# EAGLE design Peachy1-99-6-f (EAGLE 6.5.0)

## Sheet 1 of 4
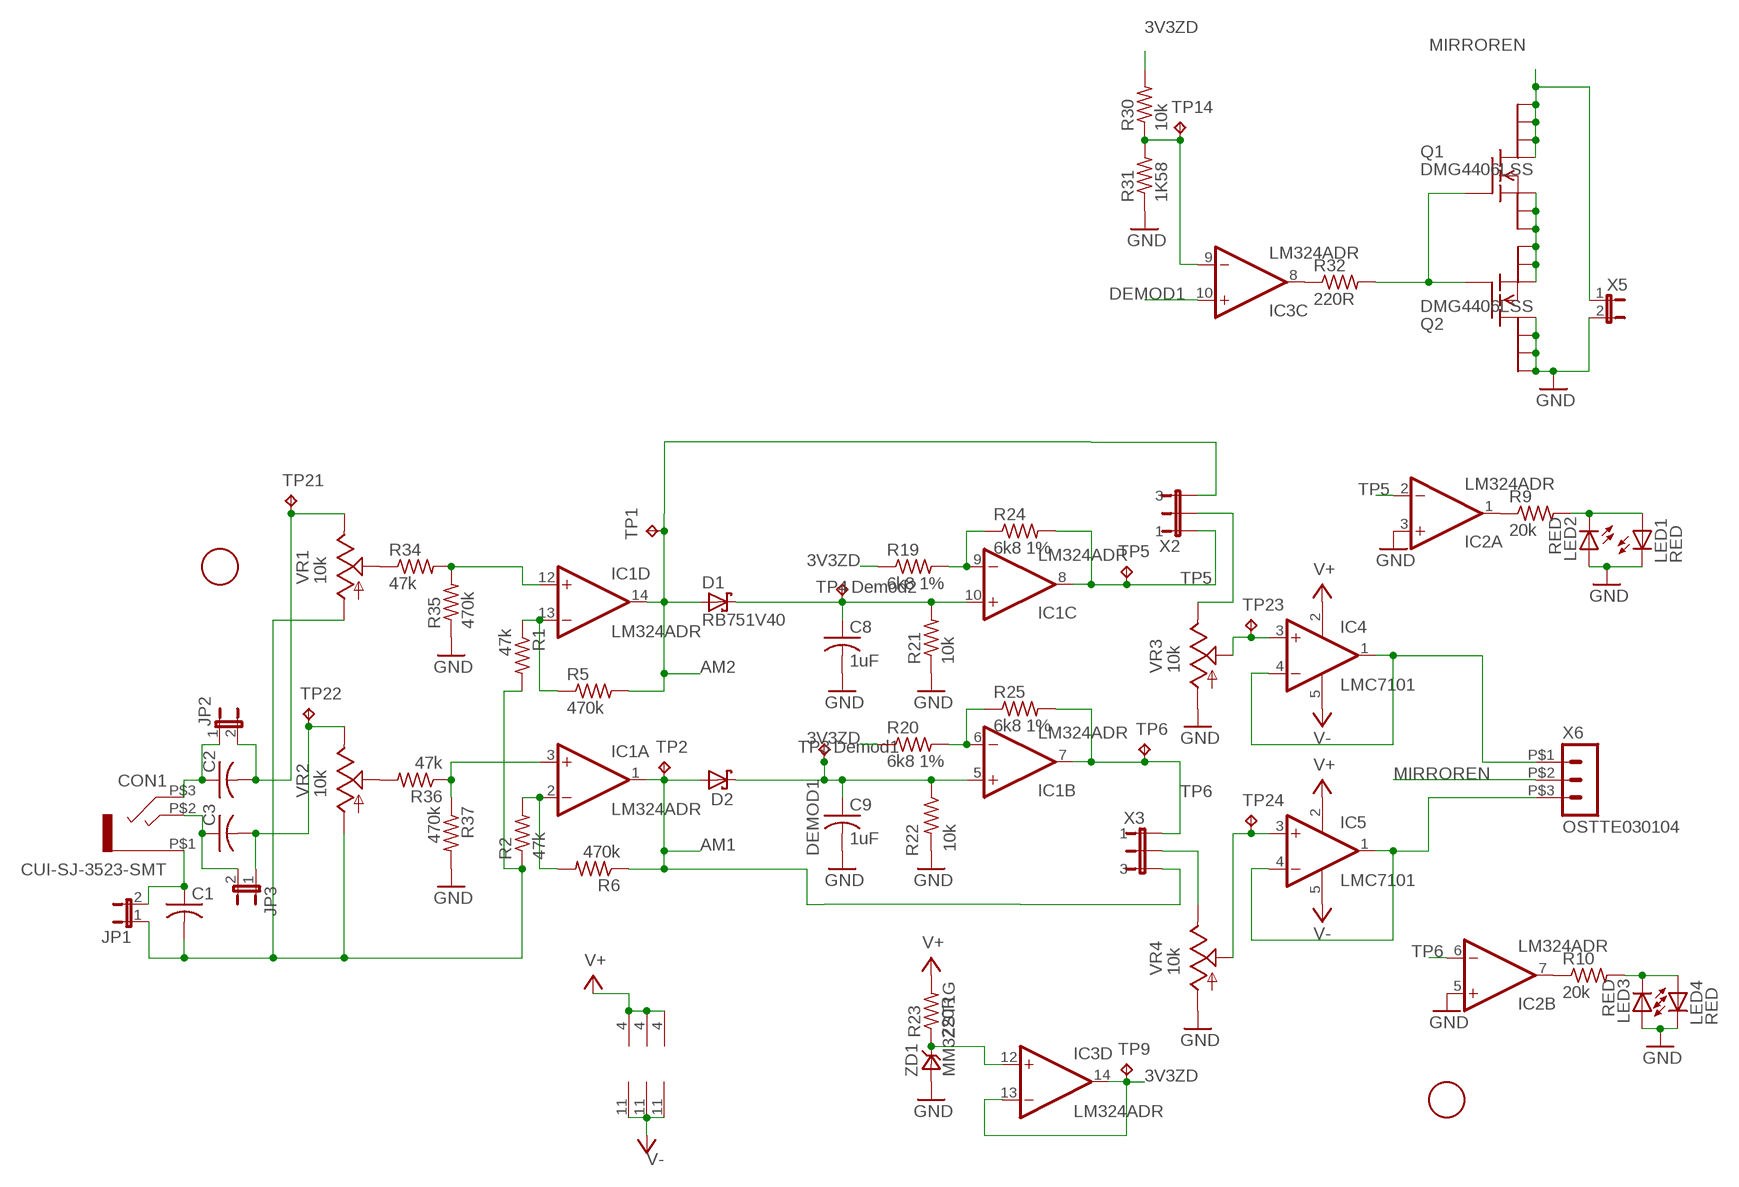
[diagram p0: schematic, sheet 1]

### Parts
C1  C-US0805  [C0805]
C2  C-US0805  [C0805]
C3  C-US0805  [C0805]
C8  1uF  C-US0805  [C0805]
C9  1uF  C-US0805  [C0805]
CON1  CUI-SJ-3523-SMT  [CUI-SJ-3523-SMT]
D1  RB751V40  [SOD323-R]
D2  RB751V40  [SOD323-R]
IC1  LM324ADR  [SOIC14(TI-PKG-D)]
IC2  LM324ADR  [SOIC14(TI-PKG-D)]
IC3  LM324ADR  [SOIC14(TI-PKG-D)]
IC4  LMC7101  [SOT23-5]
IC5  LMC7101  [SOT23-5]
JP1  JUMPER-2SMD-NC  [SJ_2S]
JP2  JUMPER-2SMD-NC  [SJ_2S]
JP3  JUMPER-2SMD-NC  [SJ_2S]
LED1  RED  LEDCHIPLED_0603  [CHIPLED_0603]
LED2  RED  LEDCHIPLED_0603  [CHIPLED_0603]
LED3  RED  LEDCHIPLED_0603  [CHIPLED_0603]
LED4  RED  LEDCHIPLED_0603  [CHIPLED_0603]
Q1  DMG4406LSS  [SO8_DMG]
Q2  DMG4406LSS  [SO8_DMG]
R1  47k  R-US_R0805  [R0805]
R2  47k  R-US_R0805  [R0805]
R5  470k  R-US_R0805  [R0805]
R6  470k  R-US_R0805  [R0805]
R9  20k  R-US_R0805  [R0805]
R10  20k  R-US_R0805  [R0805]
R19  6k8 1%  R-US_R0805  [R0805]
R20  6k8 1%  R-US_R0805  [R0805]
R21  10k  R-US_R0805  [R0805]
R22  10k  R-US_R0805  [R0805]
R23  220R  R-US_R0805  [R0805]
R24  6k8 1%  R-US_R0805  [R0805]
R25  6k8 1%  R-US_R0805  [R0805]
R30  10k  R-US_R0805  [R0805]
R31  1K58  R-US_R0805  [R0805]
R32  220R  R-US_R0805  [R0805]
R34  47k  R-US_R0805  [R0805]
R35  470k  R-US_R0805  [R0805]
R36  47k  R-US_R0805  [R0805]
R37  470k  R-US_R0805  [R0805]
TP1  TP017HOLE  [TP017TH]
TP2  TP017HOLE  [TP017TH]
TP3  TP017HOLE  [TP017TH]
TP4  TP017HOLE  [TP017TH]
TP5  TP017HOLE  [TP017TH]
TP6  TP017HOLE  [TP017TH]
TP9  TP017HOLE  [TP017TH]
TP14  TP017HOLE  [TP017TH]
TP21  TP017HOLE  [TP017TH]
TP22  TP017HOLE  [TP017TH]
TP23  TP017HOLE  [TP017TH]
TP24  TP017HOLE  [TP017TH]
U$2  FIDUCIAL  [FIDUCIAL_1MM]
U$3  FIDUCIAL  [FIDUCIAL_1MM]
VR1  10k  TRIM_US-67W  [67W]
VR2  10k  TRIM_US-67W  [67W]
VR3  10k  TRIM_US-PVZ3A  [PVZ3A]
VR4  10k  TRIM_US-PVZ3A  [PVZ3A]
X2  JUMPER-31-2  [SJ_3_PASTE1&2]
X3  JUMPER-31-2  [SJ_3_PASTE1&2]
X5  JUMPER-2SMD-NO  [SJ_2S-NO]
X6  OSTTE030104  [OSTTE030104]
ZD1  MM3ZST1G  [SOD323-R]

### Nets
3V3ZD: IC3.13(D:-IN) IC3.14(D:OUT) R19.1 R20.1 R30.2 TP9.P$1(TP) ; also sheet 3
AM1: D2.A IC1.1(A:OUT) R6.1 TP2.P$1(TP) X3.3 ; also sheet 3
AM2: D1.A IC1.14(D:OUT) R5.2 TP1.P$1(TP) X2.3
DEMOD1: C9.1 D2.C IC1.5(B:+IN) IC3.10(C:+IN) R22.1 TP3.P$1(TP)
DEMOD2: C8.1 D1.C IC1.10(C:+IN) R21.2 TP4.P$1(TP)
GND [pwr]: C8.2 C9.2 IC2.3(A:+IN) IC2.5(B:+IN) LED1.C LED2.A LED3.A LED4.C Q2.P$5(D) Q2.P$6(D) Q2.P$7(D) Q2.P$8(D) R21.1 R22.2 R31.1 R35.1 R37.2 VR3.P$1(A) VR4.P$1(A) X5.2 ZD1.A ; also sheet 2,3,4
MIRROREN [pwr]: Q1.P$5(D) Q1.P$6(D) Q1.P$7(D) Q1.P$8(D) X5.1 X6.P$2
N$3: C3.2 JP3.1 TP22.P$1(TP) VR2.E
N$4 [pwr]: C1.2 JP1.1 R1.2 R2.1 VR1.A VR2.A
N$5: R34.1 VR1.S
N$6: IC1.13(D:-IN) R1.1 R5.1
N$8: IC1.12(D:+IN) R34.2 R35.2
N$9: VR4.P$3(E) X3.2
N$10: IC3.12(D:+IN) R23.1 ZD1.C
N$12: IC1.2(A:-IN) R2.2 R6.2
N$13: IC4.3(+IN) TP23.P$1(TP) VR3.P$2(S)
N$14: R36.2 VR2.S
N$15: IC1.3(A:+IN) R36.1 R37.1
N$17: IC1.9(C:-IN) R19.2 R24.1
N$18: IC2.1(A:OUT) R9.1
N$19: IC1.6(B:-IN) R20.2 R25.1
N$20: IC2.7(B:OUT) R10.1
N$21 [pwr]: IC5.1(OUT) IC5.4(-IN) X6.P$3
N$22 [pwr]: IC4.1(OUT) IC4.4(-IN) X6.P$1
N$23: VR3.P$3(E) X2.2
N$24: IC5.3(+IN) TP24.P$1(TP) VR4.P$2(S)
N$28: Q1.P$4(G) Q2.P$4(G) R32.2
N$32: Q1.P$1(S) Q1.P$2(S) Q1.P$3(S) Q2.P$1(S) Q2.P$2(S) Q2.P$3(S)
N$38: IC3.9(C:-IN) R30.1 R31.2 TP14.P$1(TP)
N$39: LED1.A LED2.C R9.2
N$42: IC3.8(C:OUT) R32.1
N$44: LED3.C LED4.A R10.2
N$51: C1.1 CON1.P$1 JP1.2
N$52: C3.1 CON1.P$2 JP3.2
N$53: C2.1 CON1.P$3 JP2.1
N$54: C2.2 JP2.2 TP21.P$1(TP) VR1.E
TP5: IC1.8(C:OUT) IC2.2(A:-IN) R24.2 TP5.P$1(TP) X2.1
TP6: IC1.7(B:OUT) IC2.6(B:-IN) R25.2 TP6.P$1(TP) X3.1
V+: IC1.4(P:V+) IC2.4(P:V+) IC3.4(P:V+) IC4.2(V+) IC5.2(V+) R23.2 ; also sheet 2,3
V-: IC1.11(P:V-) IC2.11(P:V-) IC3.11(P:V-) IC4.5(V-) IC5.5(V-) ; also sheet 2
Unconnected: IC2.12(D:+IN) IC2.13(D:-IN) IC2.14(D:OUT)

## Sheet 2 of 4: Power Supply
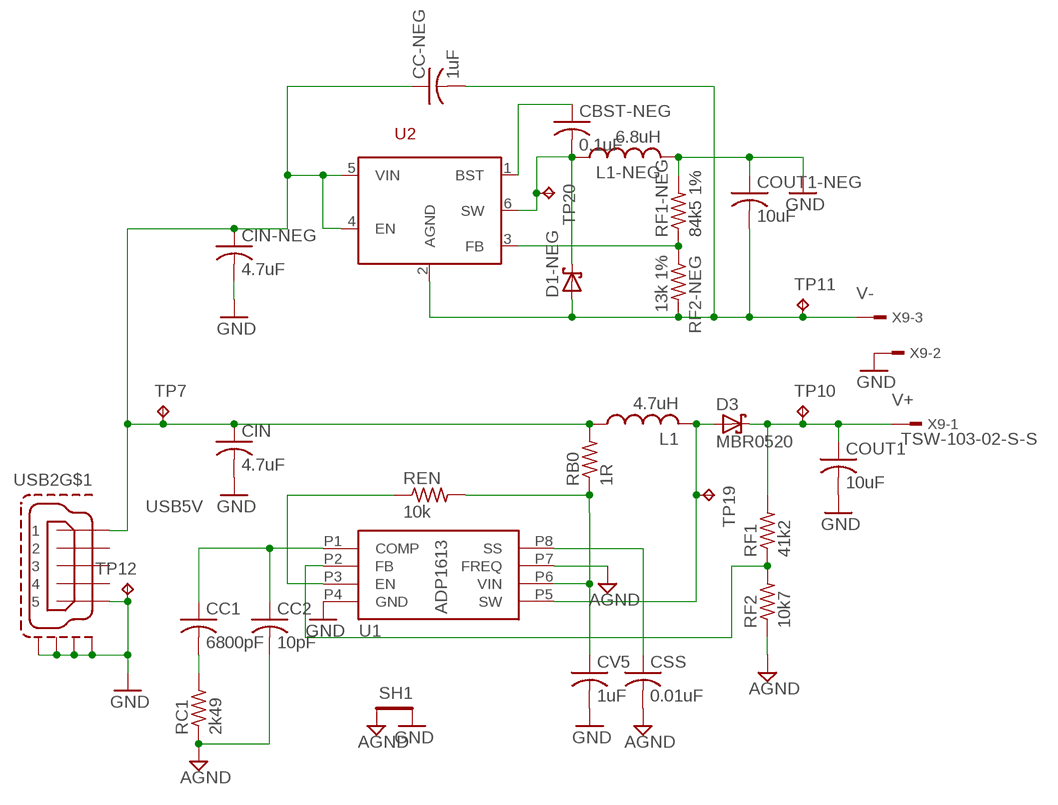
[diagram p1: schematic, sheet 2]

### Parts
CBST-NEG  0.1uF  C-US0805  [C0805]
CC1  6800pF  C-US0805  [C0805]
CC2  10pF  C-US0805  [C0805]
CC-NEG  1uF  C-US0805  [C0805]
CIN  4.7uF  C-US0805  [C0805]
CIN-NEG  4.7uF  C-US0805  [C0805]
COUT1  10uF  C-US0805  [C0805]
COUT1-NEG  10uF  C-US0805  [C0805]
CSS  0.01uF  C-US0805  [C0805]
CV5  1uF  C-US0805  [C0805]
D1-NEG  MBR0520  SCHOTTKYSOD123  [SOD123]
D3  MBR0520  SCHOTTKYSOD123  [SOD123]
L1  4.7uH  L-USL1210  [L1210]
L1-NEG  6.8uH  L-USL1210  [L1210]
RB0  1R  R-US_R0805  [R0805]
RC1  2k49  R-US_R0805  [R0805]
REN  10k  R-US_R0805  [R0805]
RF1  41k2  R-US_R0805  [R0805]
RF1-NEG  84k5 1%  R-US_R0805  [R0805]
RF2  10k7  R-US_R0805  [R0805]
RF2-NEG  13k 1%  R-US_R0805  [R0805]
SH1  SHORT-HT5  [SHORT_TOP-50]
TP7  TP017HOLE  [TP017TH]
TP10  TP017HOLE  [TP017TH]
TP11  TP017HOLE  [TP017TH]
TP12  TP017HOLE  [TP017TH]
TP19  TP017HOLE  [TP017TH]
TP20  TP017HOLE  [TP017TH]
U1  ADP1613  [RM-8]
U2  ADP2300  [TSOT23-6]
USB2  FCI-MICROUSBAPCIRCUITS  [FCI-USB-10118193-APCIRCUITS]
X9  TSW-103-02-S-S  [TSW-103-02-S-S]

### Nets
AGND [pwr]: CC2.2 CSS.2 RC1.1 RF2.1 SH1.1 U1.P7(FREQ)
BOOST: CBST-NEG.1 U2.1(BST)
GND [pwr]: CIN-NEG.2 CIN.2 COUT1-NEG.1 COUT1.2 CV5.2 L1-NEG.2 RF1-NEG.2 SH1.2 TP12.P$1(TP) U1.P4(GND) USB2.P$5 USB2.P$6(S1) USB2.P$7(S2) USB2.P$8(S3) USB2.P$11(S4) X9.2 ; also sheet 1,3,4
N$1: CV5.1 RB0.1 REN.2 U1.P6(VIN)
N$2: REN.1 U1.P3(EN)
N$16: CSS.1 U1.P8(SS)
N$34: RF1.1 RF2.2 U1.P2(FB)
N$35: CC1.1 CC2.1 U1.P1(COMP)
N$36: CC1.2 RC1.2
N$40: RF1-NEG.1 RF2-NEG.1 U2.3(FB)
SW+: D3.A L1.2 TP19.P$1(TP) U1.P5(SW)
SW-: CBST-NEG.2 D1-NEG.C L1-NEG.1 TP20.P$1(TP) U2.6(SW)
USB5V [pwr]: CC-NEG.1 CIN-NEG.1 CIN.1 L1.1 RB0.2 TP7.P$1(TP) U2.4(EN) U2.5(VIN) USB2.P$1
V+: COUT1.1 D3.C RF1.2 TP10.P$1(TP) X9.1 ; also sheet 1,3
V-: CC-NEG.2 COUT1-NEG.2 D1-NEG.A RF2-NEG.2 TP11.P$1(TP) U2.2(AGND) X9.3 ; also sheet 1
Unconnected: USB2.P$2 USB2.P$3 USB2.P$4

## Sheet 3 of 4: Laser Control
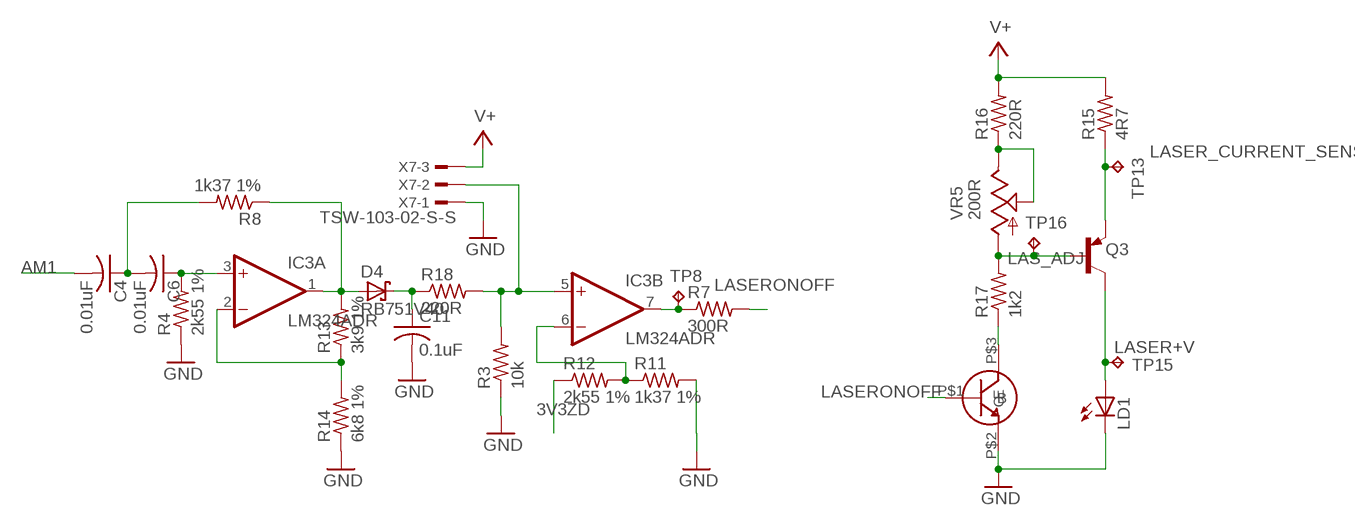
[diagram p2: schematic, sheet 3]

### Parts
C4  0.01uF  C-US0805  [C0805]
C6  0.01uF  C-US0805  [C0805]
C11  0.1uF  C-US0805  [C0805]
D4  RB751V40  [SOD323-R]
LD1  LASERDIODELD2  [LASERDIODE2]
Q3  BC857CT  [SC-75]
Q4  MMBT3904  [SOT23]
R3  10k  R-US_R0805  [R0805]
R4  2k55 1%  R-US_R0805  [R0805]
R7  300R  R-US_R0805  [R0805]
R8  1k37 1%  R-US_R0805  [R0805]
R11  1k37 1%  R-US_R0805  [R0805]
R12  2k55 1%  R-US_R0805  [R0805]
R13  3k9 1%  R-US_R0805  [R0805]
R14  6k8 1%  R-US_R0805  [R0805]
R15  4R7  R-US_R0805  [R0805]
R16  220R  R-US_R0805  [R0805]
R17  1k2  R-US_R0805  [R0805]
R18  220R  R-US_R0805  [R0805]
TP8  TP017HOLE  [TP017TH]
TP13  TP017HOLE  [TP017TH]
TP15  TP017HOLE  [TP017TH]
TP16  TP017HOLE  [TP017TH]
VR5  200R  TRIM_US-TC33X  [TC33X]
X7  TSW-103-02-S-S  [TSW-103-02-S-S]

### Nets
3V3ZD: R12.1 ; also sheet 1
AM1: C4.2 ; also sheet 1
GND [pwr]: C11.2 LD1.P$3(C) Q4.P$2(E) R3.1 R4.1 R11.2 R14.1 X7.1 ; also sheet 1,2,4
LASERONOFF: Q4.P$1(B) R7.2
N$7: IC3.5(B:+IN) R3.2 R18.2 X7.2
N$11: IC3.6(B:-IN) R11.1 R12.2
N$25: IC3.2(A:-IN) R13.1 R14.2
N$26: LD1.P$1(A) Q3.P$3(C) TP15.P$1(TP)
N$27: IC3.7(B:OUT) R7.1 TP8.P$1(TP)
N$29: C6.1 IC3.3(A:+IN) R4.2
N$30: C4.1 C6.2 R8.2
N$31: D4.A IC3.1(A:OUT) R8.1 R13.2
N$33: C11.1 D4.C R18.1
N$37: R16.1 VR5.P$2(S) VR5.P$3(E)
N$45: Q3.P$1(B) R17.2 TP16.P$1(TP) VR5.P$1(A)
N$46: Q4.P$3(C) R17.1
N$49: Q3.P$2(E) R15.1 TP13.P$1(TP)
V+: R15.2 R16.2 X7.3 ; also sheet 1,2

## Sheet 4 of 4: Depth Sensor
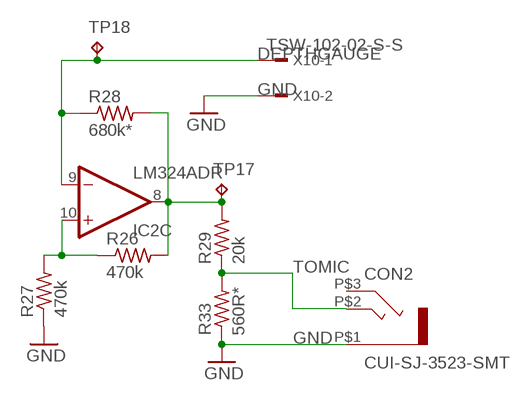
[diagram p3: schematic, sheet 4]

### Parts
CON2  CUI-SJ-3523-SMT  [CUI-SJ-3523-SMT]
R26  470k  R-US_R0805  [R0805]
R27  470k  R-US_R0805  [R0805]
R28  680k*  R-US_SOCKET(.1)  [70543-02]
R29  20k  R-US_R0805  [R0805]
R33  560R*  R-US_R0805  [R0805]
TP17  TP017HOLE  [TP017TH]
TP18  TP017HOLE  [TP017TH]
X10  TSW-102-02-S-S  [TSW-102-02-S-S]

### Nets
DEPTHGAUGE: IC2.9(C:-IN) R28.1 TP18.P$1(TP) X10.1
GND [pwr]: CON2.P$1 R27.1 R33.1 X10.2 ; also sheet 1,2,3
N$47: IC2.8(C:OUT) R26.2 R28.2 R29.2 TP17.P$1(TP)
N$48: IC2.10(C:+IN) R26.1 R27.2
TOMIC: CON2.P$2 R29.1 R33.2
Unconnected: CON2.P$3

## Library data of the parts
C1-C3 = Scott:C-US: CAPACITOR, American symbol
C4 C6 CSS = Scott:C-US: CAPACITOR, American symbol; MPN: CL21B103KBANNNC
C8 C9 CC-NEG CV5 = Scott:C-US: CAPACITOR, American symbol; MPN: CL21B105KBFNNNE
C11 CBST-NEG = Scott:C-US: CAPACITOR, American symbol; MPN: CL21B104KACNNNC
CC1 = Scott:C-US: CAPACITOR, American symbol; MPN: CL21B682KBANNNC
CC2 = Scott:C-US: CAPACITOR, American symbol; MPN: CL21C100JCANNNC
CIN CIN-NEG = Scott:C-US: CAPACITOR, American symbol; MPN: CL21A475KOFNNNE
CON1 CON2 = Scott:CUI-SJ-3523-SMT; MPN: SJ-3523-SMT-TR
COUT1 COUT1-NEG = Scott:C-US: CAPACITOR, American symbol; MPN: CL21B106KQQNNNE
D1 D2 D4 = Scott:RB751; MPN: RB751V40,115
D1-NEG D3 = Scott:SCHOTTKY; MPN: MBR0520LT3G
IC1-IC3 = Scott:LM324: OP AMP; MPN: LM324ADR
IC4 IC5 = Scott:LMC7101; MPN: LMC7101BYM5
JP1-JP3 X5 = Scott:JUMPER-2: Jumper Basic 0.1" spaced jumper. Use with breakaway headers.
L1 = Scott:L-US: INDUCTOR, American symbol; MPN: LQH32PN4R7NN0L
L1-NEG = Scott:L-US: INDUCTOR, American symbol; MPN: LQH32PN6R8NN0
LD1 = Scott:LASERDIODE; MPN: 3 x (0552-2-15-15-11-27-10-0)
LED1-LED4 = Scott:LED: LED OSRAM: - CHIPLED LG R971, LG N971, LY N971, LG Q971, LY Q971, LO R971, LY R971 LH N974, LH R974 LS Q976, LO Q976, LY Q976 LO Q996 - Hyper CHIPLED LW Q18S LB Q993, LB Q99A, LB R99A - SideLED LS A670, LO A670, LY A670, LG A670, LP A670 LB A673, LV A673, LT A673, LW A673 LH A674 LY A675 LS A676, LA A676, LO A676, LY A676, LW A676 LS A679, LY A679, LG A679 - Hyper Micro SIDELED® LS Y876, LA Y876, LO Y876, LY Y876 LT Y87S - SmartLED LW L88C, LW L88S LB L89C, LB L89S, LG L890 LS L89K, LO L89K, LY L89K LS L896, LA L896, LO L896, LY L896 - TOPLED LS T670, LO T670, LY T670, LG T670, LP T670 LSG T670, LSP T670, LSY T670, LOP T670, LYG T670 LG T671, LOG T671, LSG T671 LB T673, LV T673, LT T673, LW T673 LH T674 LS T676, LA T676, LO T676, LY T676, LB T676, LH T676, LSB T676, LW T676 LB T67C, LV T67C, LT T67C, LS T67K, LO T67K, LY T67K, LW E67C LS E67B, LA E67B, LO E67B, LY E67B, LB E67C, LV E67C, LT E67C LW T67C LS T679, LY T679, LG T679 LS T770, LO T770, LY T770, LG T770, LP T770 LB T773, LV T773, LT T773, LW T773 LH T774 LS E675, LA E675, LY E675, LS T675 LS T776, LA T776, LO T776, LY T776, LB T776 LHGB T686 LT T68C, LB T68C - Hyper Mini TOPLED® LB M676 - Mini TOPLED Santana® LG M470 LS M47K, LO M47K, LY M47K Source: http://www.osram.convergy.de LUXEON: - LUMILED® LXK2-PW12-R00, LXK2-PW12-S00, LXK2-PW14-U00, LXK2-PW14-V00 LXK2-PM12-R00, LXK2-PM12-S00, LXK2-PM14-U00 LXK2-PE12-Q00, LXK2-PE12-R00, LXK2-PE12-S00, LXK2-PE14-T00, LXK2-PE14-U00 LXK2-PB12-K00, LXK2-PB12-L00, LXK2-PB12-M00, LXK2-PB14-N00, LXK2-PB14-P00, LXK2-PB14-Q00 LXK2-PR12-L00, LXK2-PR12-M00, LXK2-PR14-Q00, LXK2-PR14-R00 LXK2-PD12-Q00, LXK2-PD12-R00, LXK2-PD12-S00 LXK2-PH12-R00, LXK2-PH12-S00 LXK2-PL12-P00, LXK2-PL12-Q00, LXK2-PL12-R00 Source: www.luxeon.com KINGBRIGHT: KA-3528ASYC Source: www.kingbright.com; MPN: LS L29K-G1J2-1-Z
Q1 Q2 = Scott:DMG4406LSS; MPN: DMG4406LSS-13
Q3 = Scott:BC857CT; MPN: BC857CT,115
Q4 = Scott:MMBT3904; MPN: MMBT3904,215
R1 R2 R34 R36 = Scott:R-US_: RESISTOR, American symbol; DIGIKEY: RMCF0805JT47K0CT-ND; MPN: RMCF0805JT47K0
R3 R21 R22 R30 REN = Scott:R-US_: RESISTOR, American symbol; MPN: RMCF0805JT10K0
R4 R12 = Scott:R-US_: RESISTOR, American symbol; MPN: RC0805FR-072K55L
R5 R6 R26 R27 R35 R37 = Scott:R-US_: RESISTOR, American symbol; MPN: RMCF0805JT470K
R7 = Scott:R-US_: RESISTOR, American symbol; MPN: RC0805JR-07300RL
R8 R11 = Scott:R-US_: RESISTOR, American symbol; MPN: RC0805FR-071K37L
R9 R10 R29 = Scott:R-US_: RESISTOR, American symbol; MPN: RMCF0805JT20K0
R13 = Scott:R-US_: RESISTOR, American symbol; MPN: RC0805FR-073K9L
R14 R19 R20 R24 R25 = Scott:R-US_: RESISTOR, American symbol; MPN: RC0805FR-076K8L
R15 = Scott:R-US_: RESISTOR, American symbol; MPN: RMCF0805JT4R70
R16 R18 R23 R32 = Scott:R-US_: RESISTOR, American symbol; MPN: RMCF0805JT220R
R17 = Scott:R-US_: RESISTOR, American symbol; MPN: RC2012J122CS
R28 = Scott:R-US_: RESISTOR, American symbol; MPN: PPTC021LFBN-RC
R31 = Scott:R-US_: RESISTOR, American symbol; MPN: RC0805FR-071K58L
R33 = Scott:R-US_: RESISTOR, American symbol; MPN: RMCF0805JT560R
RB0 = Scott:R-US_: RESISTOR, American symbol; MPN: RMCF0805JT1R00
RC1 = Scott:R-US_: RESISTOR, American symbol; MPN: RMCF0805FT2K49
RF1 = Scott:R-US_: RESISTOR, American symbol; MPN: RC0805FR-0741K2L
RF1-NEG = Scott:R-US_: RESISTOR, American symbol; MPN: RC0805FR-0784K5L
RF2 = Scott:R-US_: RESISTOR, American symbol; MPN: RC2012F1072CS
RF2-NEG = Scott:R-US_: RESISTOR, American symbol; MPN: RC0805FR-0713KL
SH1 = Scott:SHORT-H: Short between two nets; BOM: no
TP1 = Scott:TP: Test pad; TP_SIGNAL_NAME: Preamp2
TP2 = Scott:TP: Test pad; TP_SIGNAL_NAME: Preamp1
TP3 = Scott:TP: Test pad; TP_SIGNAL_NAME: Demod1
TP4 = Scott:TP: Test pad; TP_SIGNAL_NAME: Demod2
TP5 = Scott:TP: Test pad; TP_SIGNAL_NAME: TP5
TP6 = Scott:TP: Test pad; TP_SIGNAL_NAME: TP6
TP7-TP9 TP12 TP14 TP17 TP18 TP20-TP24 = Scott:TP: Test pad
TP10 = Scott:TP: Test pad; TP_SIGNAL_NAME: +V
TP11 = Scott:TP: Test pad; TP_SIGNAL_NAME: V-
TP13 = Scott:TP: Test pad; TP_SIGNAL_NAME: LASER_CURRENT_SENSE
TP15 = Scott:TP: Test pad; TP_SIGNAL_NAME: LASER+V
TP16 = Scott:TP: Test pad; TP_SIGNAL_NAME: LAS_ADJ
TP19 = Scott:TP: Test pad; TP_SIGNAL_NAME: SW+
U1 = Scott:ADP1613; MPN: ADP1613ARMZ-R7
U2 = Scott:ADP2300: Nonsynchronous Step-Down Regulator; MPN: ADP2300AUJZ-R7
U$2 U$3 = Scott:FIDUCIAL: For use by pick and place machines to calibrate the vision/machine, 1mm By microbuilder.eu
USB2 = Scott:FCI-MICROUSB; MPN: 10118193-0001LF
VR1 VR2 = Scott:TRIM_US-: POTENTIOMETER 3mm SMD Trimpot muRata PVZ3A/H/G (not K); MPN: 67WR10KLF
VR3 VR4 = Scott:TRIM_US-: POTENTIOMETER 3mm SMD Trimpot muRata PVZ3A/H/G (not K); MPN: PVZ3A103C01R00
VR5 = Scott:TRIM_US-: POTENTIOMETER 3mm SMD Trimpot muRata PVZ3A/H/G (not K); MPN: ???
X2 X3 = Scott:JUMPER-3
X6 = Scott:OSTTE030104; MPN: OSTTE030104; NOTE: Try 1984976
X7 X9 = Scott:TSW-103-02-S-S: THROUGH-HOLE .025" SQ POST HEADER Source: Samtec TSW.pdf; MPN: TSW-103-07-T-S; OC_FARNELL: unknown; OC_NEWARK: unknown
X10 = Scott:TSW-102-02-S-S: THROUGH-HOLE .025" SQ POST HEADER Source: Samtec TSW.pdf; OC_FARNELL: unknown; OC_NEWARK: unknown
ZD1 = Scott:MM3Z; MPN: BZX384-B3V3,115

## Net classes
0 default: width 0.254 mm, drill 0.432 mm, clearance 0.203 mm
1 pwr: width 0.305 mm, drill 0.432 mm, clearance 0.203 mm

## Board
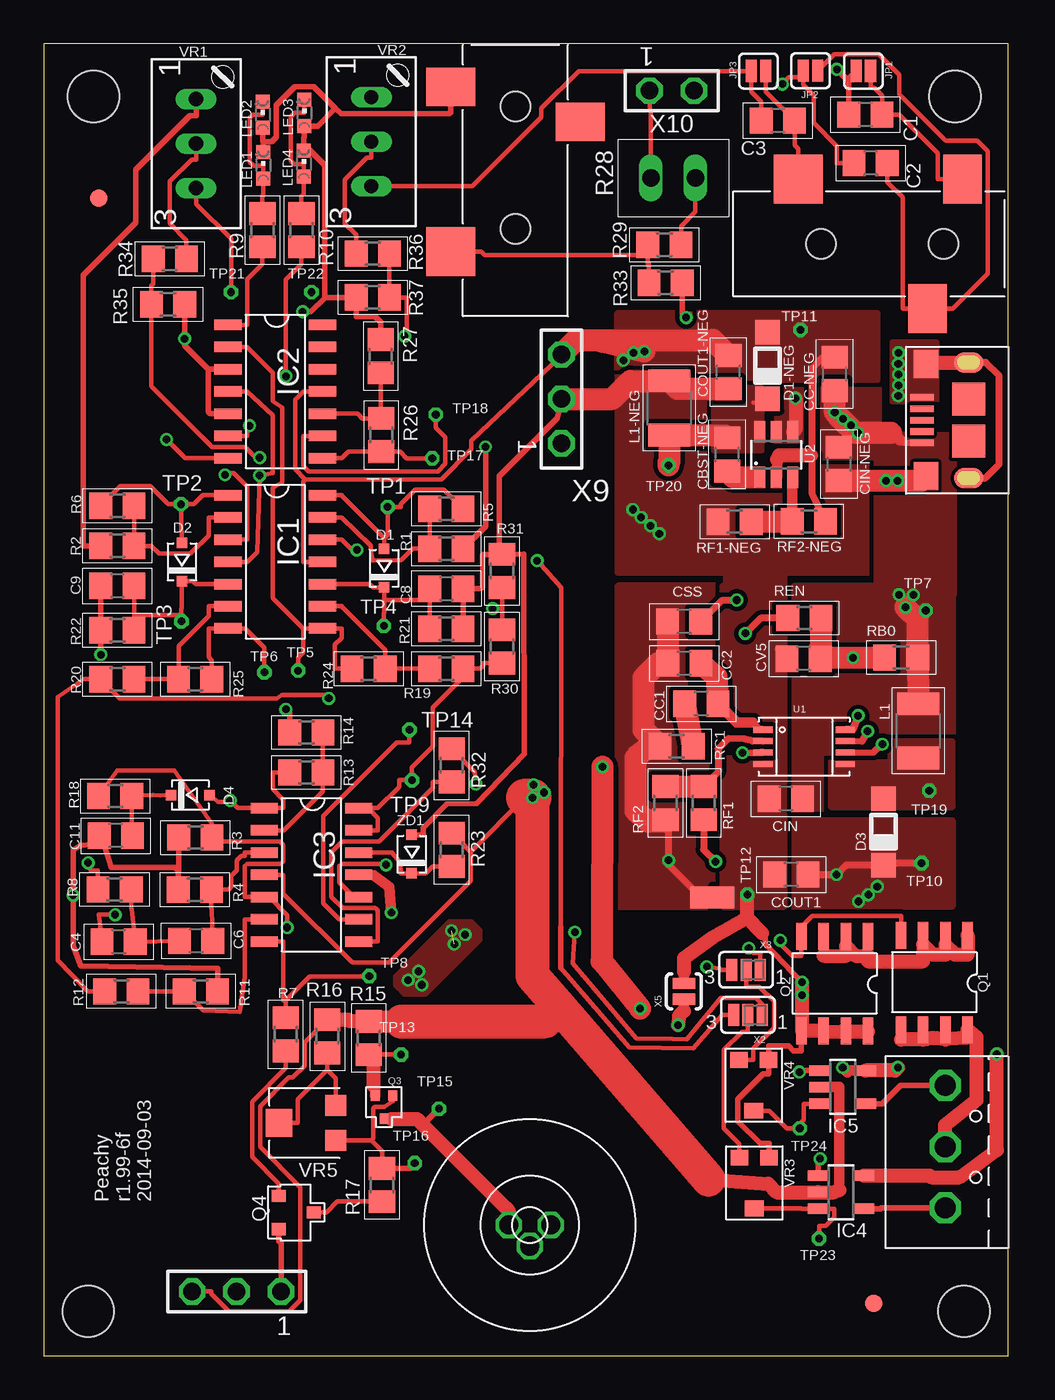
[diagram p4: board, top side]
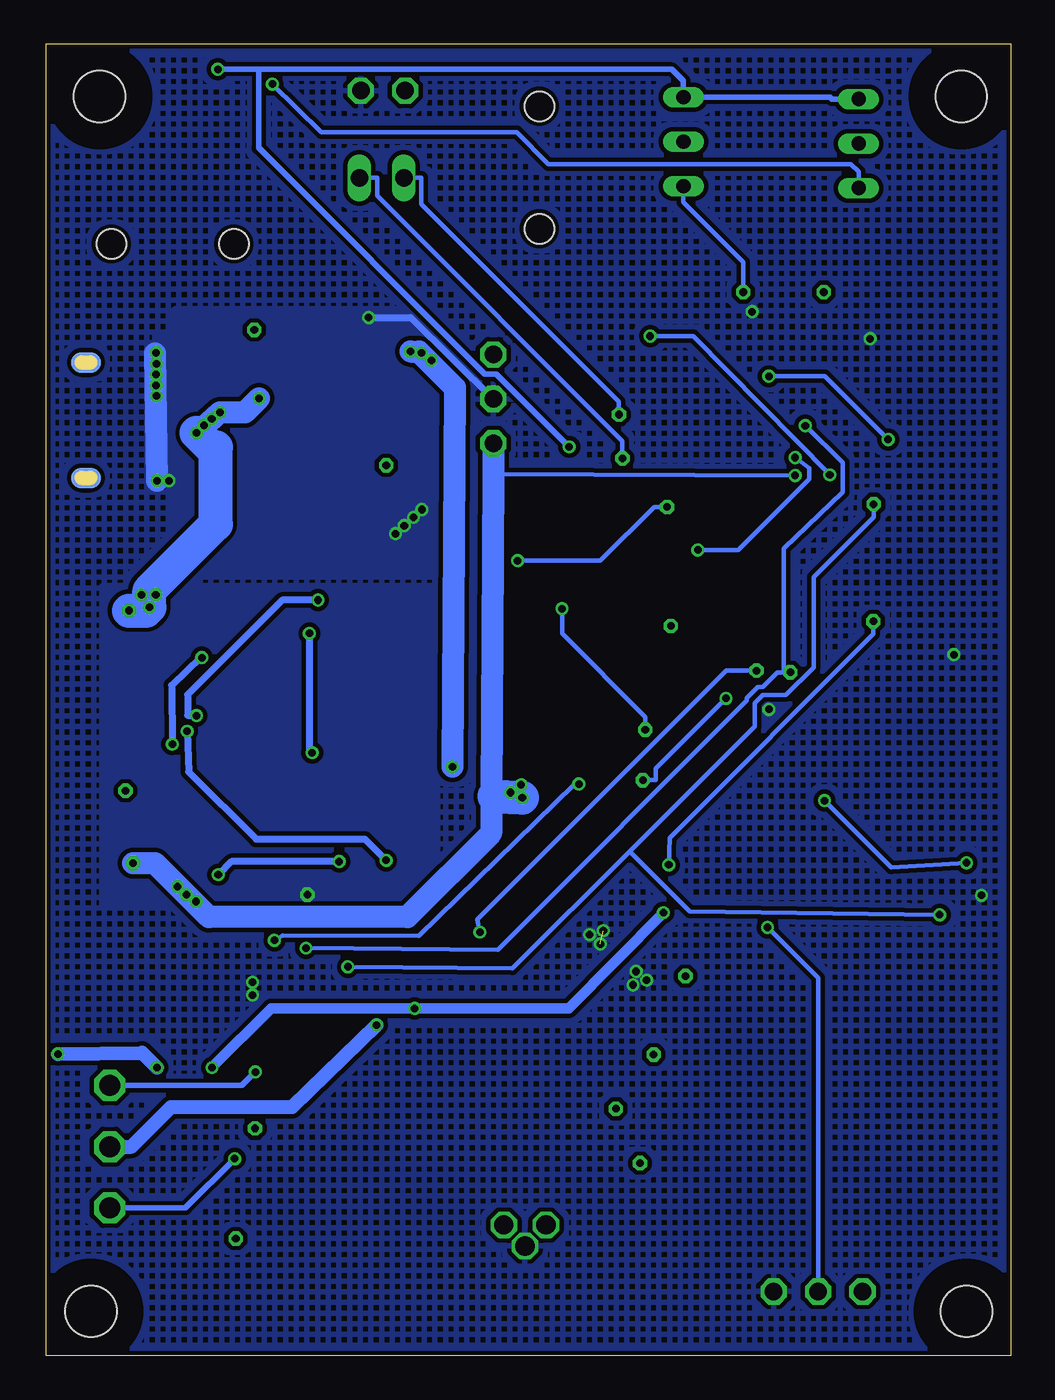
[diagram p5: board, bottom side, seen from below]

Size 55.12 x 75 mm. Coordinates in mm from the lower left corner, seen from the top.
Outline: 0,0 55.12,0 55.12,75 0,75 0,0
Copper layers (1*16): Top 0.035mm / dielectric 1.5mm / Bottom 0.035mm
Design rules "Peachy2_Modified_from_SeeedStudio_2layer_DRU_no_angle_20140221 *": minimum track width 6mil, minimum drill 12mil, track to track 8mil, track to pad 8mil, pad to pad 8mil, via to via 8mil, smd to smd 0mil, copper to edge 10mil, drill to drill 10mil, minimum pad ring 7mil, minimum via ring 6mil, stop-mask expansion 2mil, vias tented up to drill 100mil, thermal gap 10mil
Holes 2.95 mm at 2.54,2.54 52.58,2.54 52.08,71.98 2.84,71.98
bRestrict: area -0.2,-0.2 to 5.3,5.3; area 0.1,69.2 to 5.6,74.7; area 49.3,69.2 to 54.8,74.7; area 49.8,-0.2 to 55.3,5.3

### Footprints (pad centres in the part's own frame; a part is rotated, then mirrored left to right if it is on the bottom)
C0805 = smd 1.3 x 1.5: 1 -0.95,0; 2 0.95,0
CUI-SJ-3523-SMT = smd 2.2 x 2.8: P$1 -1.1,-3.7; P$3 0.9,3.7 | smd 2.8 x 2.8: P$2 8.3,-3.7 | hole 1.7: 0,0; 7,0
SOD323-R = smd 0.6 x 0.6: A 1.1,0; C -1.1,0
SOD123 = smd 1.4 x 1.4: A 1.9,0; C -1.9,0
SOIC14(TI-PKG-D) = smd 0.6 x 1.55: 1 0,0; 2 1.27,0; 3 2.54,0; 4 3.81,0; 5 5.08,0; 6 6.35,0; 7 7.62,0; 8 7.62,5.4; 9 6.35,5.4; 10 5.08,5.4; 11 3.81,5.4; 12 2.54,5.4; 13 1.27,5.4; 14 0,5.4
SOT23-5 = smd 0.6 x 1.2: 1 -0.95,-1.306; 2 0,-1.306; 3 0.95,-1.306; 4 0.95,1.306; 5 -0.95,1.306
SJ_2S = smd 0.635 x 1.27: 1 -0.412,0; 2 0.412,0
L1210 = smd 1.3 x 2.4: 1 -1.55,0; 2 1.55,0
LASERDIODE2 = drill 1.092 pad 1.499 octagon: P$1 0,1.203; P$2 0,-1.203; P$3 -1.203,0
CHIPLED_0603 = smd 0.8 x 0.8: A 0,-0.75; C 0,0.75
SO8_DMG = smd 1.55 x 0.6: P$1 -2.7,2; P$2 -2.7,0.73; P$3 -2.7,-0.54; P$4 -2.7,-1.81; P$5 2.7,-1.81; P$6 2.7,-0.54; P$7 2.7,0.73; P$8 2.7,2
SC-75 = smd 0.6 x 0.5: P$1 0.65,-0.5; P$2 0.65,0.5; P$3 -0.65,0
SOT23 = smd 0.7 x 0.8: P$1 0.95,0.73; P$2 -0.95,0.73; P$3 0,-1.27
R0805 = smd 1.3 x 1.5: 1 -0.95,0; 2 0.95,0
70543-02 = drill 1 long: 1 -1.27,0; 2 1.27,0
SHORT_TOP-50 = smd 1.27 x 1.27: 1 0.635,0; 2 -0.635,0
TP017TH = drill 0.432 pad 0.813 octagon: P$1 0,0
RM-8 = smd 1.1 x 0.35: P1 -2.35,0.975; P2 -2.35,0.325; P3 -2.35,-0.325; P4 -2.35,-0.975; P5 2.35,-0.975; P6 2.35,-0.325; P7 2.35,0.325; P8 2.35,0.975
TSOT23-6 = smd 0.62 x 1.22: 1 -0.95,-1.3; 2 0,-1.3; 3 0.95,-1.3; 4 0.95,1.3; 5 0,1.3; 6 -0.95,1.3
FIDUCIAL_1MM = smd 1 x 1: 1 0,0
FCI-USB-10118193-APCIRCUITS = smd 0.38 x 1.35: P$1 -1.3,2.675; P$2 -0.65,2.675; P$3 0,2.675; P$4 0.65,2.675; P$5 1.3,2.675 | smd 1.6 x 1.4: P$6 -3.2,2.45; P$7 3.2,2.45 | smd 1.16 x 1.68: P$8 -3.3,0; P$11 3.3,0 | smd 1.9 x 1.9: P$9 -1.2,0; P$10 1.2,0 | smd 1.16 x 1.68 bottom: P$12 3.3,0; P$13 -3.3,0
67W = drill 0.813 long: A 0,0; E -5.08,0; S -2.54,0
PVZ3A = smd 1 x 0.9: P$1 -0.85,-1.45; P$3 0.85,-1.45 | smd 1.1 x 0.9: P$2 0,1.45
TC33X = smd 1.2 x 1.2: P$1 -1,-1.8; P$3 1,-1.8 | smd 1.6 x 1.5: P$2 0,1.45
SJ_3_PASTE1&2 = smd 0.635 x 1.27: 1 -0.813,0; 2 0,0; 3 0.813,0
SJ_2S-NO = smd 0.635 x 1.27: 1 -0.45,0; 2 0.45,0
OSTTE030104 = drill 1.2 pad 1.778 octagon: P$1 -3.81,0; P$2 -0.31,0; P$3 3.19,0
TSW-103-02-S-S = drill 1 pad 1.5 octagon: 1 2.54,0; 2 0,0; 3 -2.54,0
TSW-102-02-S-S = drill 1 pad 1.5 octagon: 1 1.27,0; 2 -1.27,0

### Placement (x,y rotation side)
C1  46.96,70.94 180 top
C2  47.26,68.17 180 top
C3  41.96,70.6 180 top
C4  4.28,23.67 180 top
C6  8.71,23.72 180 top
C8  23.01,43.85 0 top
C9  4.21,44.01 180 top
C11  4.12,29.73 180 top
CBST-NEG  39.05,51.52 90 top
CC1  37.58,37.27 180 top
CC2  36.61,39.58 180 top
CC-NEG  45.2,56.12 90 top
CIN  42.41,31.84 180 top
CIN-NEG  45.43,50.98 270 top
CON1  51.41,63.56 180 top
CON2  26.96,71.42 270 top
COUT1  42.72,27.51 180 top
COUT1-NEG  39.12,56.22 90 top
CSS  36.6,41.97 180 top
CV5  43.42,39.85 180 top
D1  19.45,45.02 90 top
D1-NEG  41.37,56.6 90 top
D2  7.9,45.38 90 top
D3  47.99,29.95 90 top
D4  8.37,32.05 0 top
IC1  10.53,49.19 270 top
IC2  10.53,58.93 270 top
IC3  12.59,31.3 270 top
IC4  45.56,9.35 270 top
IC5  45.66,15.36 270 top
JP1  46.83,73.44 0 top
JP2  43.81,73.46 180 top
JP3  40.84,73.44 0 top
L1  49.96,35.72 270 top
L1-NEG  35.75,54.18 90 top
LD1  27.77,7.47 90 top
LED1  12.54,68.04 0 top
LED2  12.52,70.94 0 top
LED3  14.89,71.04 0 top
LED4  14.87,68.14 0 top
Q1  50.8,21.34 270 top
Q2  45.1,21.27 270 top
Q3  19.44,14.22 90 top
Q4  14.16,8.2 90 top
R1  23.01,46.13 0 top
R2  4.21,46.3 0 top
R3  8.66,29.62 0 top
R4  8.63,26.64 0 top
R5  23.01,48.42 0 top
R6  4.21,48.58 0 top
R7  13.82,18.38 270 top
R8  4.04,26.65 0 top
R9  12.5,64.34 90 top
R10  14.73,64.34 90 top
R11  8.97,20.84 0 top
R12  4.43,20.84 0 top
R13  15.01,33.34 180 top
R14  15.01,35.63 0 top
R15  18.57,18.16 90 top
R16  16.2,18.27 90 top
R17  19.33,9.77 90 top
R18  4.08,31.99 180 top
R19  23.01,39.28 180 top
R20  4.21,38.68 0 top
R21  23.01,41.56 180 top
R22  4.21,41.47 180 top
R23  23.31,28.93 90 top
R24  18.57,39.28 180 top
R25  8.65,38.68 0 top
R26  19.29,52.63 270 top
R27  19.26,57.13 270 top
R28  35.97,67.33 0 top
R29  35.47,63.51 0 top
R30  26.19,40.55 270 top
R31  26.19,44.86 270 top
R32  23.31,33.75 90 top
R33  35.53,61.32 180 top
R34  7.2,62.7 180 top
R35  7.1,60.1 180 top
R36  18.8,63 180 top
R37  18.8,60.5 180 top
RB0  48.99,39.91 0 top
RC1  36.17,34.84 0 top
REN  43.46,42.17 0 top
RF1  37.71,31.6 270 top
RF1-NEG  39.48,47.68 180 top
RF2  35.53,31.6 90 top
RF2-NEG  43.72,47.69 0 top
SH1  38.2,26.2 180 top
TP1  19.65,48.52 270 top
TP2  7.84,48.68 270 top
TP3  7.87,41.98 270 top
TP4  19.44,41.72 270 top
TP5  14.54,39.17 270 top
TP6  12.61,39.07 270 top
TP7  50.4,42.6 0 top
TP8  18.6,21.7 0 top
TP9  21.04,32.9 0 top
TP10  50.16,28.16 0 top
TP11  43.24,58.64 90 top
TP12  40.2,26.36 0 top
TP13  20.42,17.22 0 top
TP14  20.9,35.79 0 top
TP15  22.58,14.12 0 top
TP16  21.2,11.01 0 top
TP17  22.2,51.3 0 top
TP18  22.4,53.8 0 top
TP19  50.6,32.3 0 top
TP20  35.7,50.9 90 top
TP21  10.7,60.8 0 top
TP22  15.3,60.8 0 top
TP23  44.3,6.7 0 top
TP24  43.2,13 0 top
U1  43.45,34.81 0 top
U2  41.86,51.51 0 top
U$2  3.15,66.18 0 top
U$3  47.43,2.99 0 top
USB2  52.85,53.48 90 top
VR1  8.71,71.84 90 top
VR2  18.72,71.94 90 top
VR3  40.6,9.88 180 top
VR4  40.57,15.46 180 top
VR5  14.89,13.31 90 top
X2  40.24,19.49 180 top
X3  40.14,22.07 180 top
X5  36.58,20.84 90 top
X6  51.5,12.26 90 top
X7  11.02,3.67 0 top
X9  29.58,54.69 270 top
X10  35.89,72.32 180 top
ZD1  21.02,28.67 90 top

### Tracks (layer width: path | path; a pad name or v marks a point on that pad's centre or on a via)
3V3ZD  (via drill 0.43 pad 0.61)
  Top 0.254: v16.29,37.58 16.15,37.77 13.61,37.77 13.31,37.57 4.36,37.58 R20.1 2.28,38.68 0.79,37.64 0.79,22.59 2.5,20.84 R12.1 | IC3.14 18.55,31.3 | IC3.13 19.1,30.03 19.1,30.75 18.55,31.3 | 18.55,31.3 19.1,31.3 20.3,32.51 20.3,32.9 TP9.P$1 21.04,33.64 22.23,34.83 22.23,37.05 24.45,39.28 | 24.45,39.28 24.94,39.28 25.11,39.44 25.11,39.6 R30.2 | R19.1 24.45,39.28
  Bottom 0.254: TP9.P$1 20.3,32.9 20.3,33.56 v16.29,37.58
AGND  (via drill 0.43 pad 0.74)
  Top 0.356: U1.P7 46.76,35.14
  Top 0.406: 35.71,28.05 SH1.1 | v35.71,28.32 35.71,30.46 | 46.76,35.14 v47.08,35.7
  Top 1.27: 34.63,34.84 33.8,34.19 33.8,31.16 34.53,30.53 35.41,30.53 | 35.1,39.58 34.27,38.75 34.27,35.79 RC1.1 | CSS.2 35.65,39.59
  Bottom 0.406: v47.08,35.7 46.99,33.38 43.14,29.53 36.92,29.53 v35.71,28.32
  pour Top (isolate 0.254, rank 4, no thermals): 32.8,44 32.8,25.7 39,25.7 38.8,44
AM1  (via drill 0.43 pad 0.61)
  Top 0.254: X3.3 38.68,22.07 38.61,22.13 v37.89,22.23 | C4.2 3.13,25.23 3.83,25.23 v4.08,25.21 | R6.1 4.38,49.7 6.09,49.7 7.11,48.68 TP2.P$1 | TP2.P$1 8.58,48.68 9.09,49.19 IC1.1 | D2.A 7.9,47.11 7.84,47.16 TP2.P$1
  Bottom 0.254: 21.8,28.83 14.65,35.98 14.65,37.31 14.19,37.77 12.86,37.77 11.28,39.35 11.28,44.51 7.84,47.95 TP2.P$1 | v37.89,22.23 28.5,22.13 21.8,28.83 | 21.8,28.83 18.37,25.4 v4.08,25.21
AM2  (via drill 0.43 pad 0.61)
  Top 0.254: 29.55,22.17 33.46,17.61 37.13,17.57 38.78,19.49 X2.3 | 29.55,24.52 29.59,43.91 v28.2,45.45 | R5.2 22.87,49.51 21.23,49.51 20.39,48.67 20.39,48.52 TP1.P$1 19.65,46.95 19.45,46.75 | IC1.14 17.04,49.19 17.04,49.16 19.45,46.75 | D1.A 19.45,46.75
  Top 0.305: 29.55,22.17 29.53,24.2 29.55,24.52
  Bottom 0.254: TP1.P$1 20.39,48.52 23.46,45.45 v28.2,45.45
BOOST
  Top 0.61: U2.1 40.55,50.2
  Top 1.27: 40.55,50.2 39.43,50.2 CBST-NEG.1
DEMOD1  (via drill 0.43 pad 0.61)
  Top 0.254: v19.55,28.06 19.39,28.13 17.02,28.13 16.89,28 16.89,27.05 17.72,26.22 IC3.10 | 5.16,42.35 C9.1 | R22.1 5.16,42.35 | 7.87,42.35 5.16,42.35 | 7.87,42.35 7.87,42.72 7.9,42.75 D2.C 8.53,44.28 8.7,44.11 IC1.5 | TP3.P$1 7.87,42.35
  Bottom 0.254: TP3.P$1 7.87,41.24 19.5,29.61 v19.55,28.06
DEMOD2
  Top 0.254: 22.06,43.19 C8.1 | R21.2 22.06,43.19 | 19.45,43.19 D1.C 18.82,43.92 18.62,44.11 IC1.10 | 19.45,43.19 19.45,42.47 19.44,42.46 TP4.P$1 | 19.45,43.19 22.06,43.19
DEPTHGAUGE
  Top 0.254: IC2.9 14.82,52.58 14.82,50.87 15.14,50.56 22.5,50.56 22.95,51.01 22.95,52.51 22.4,53.06 TP18.P$1 | X10.1 34.62,71.24 34.7,71.16 R28.1
  Bottom 0.254: TP18.P$1 22.4,54.54 33.69,65.82 33.69,67.33 R28.1
GND  (via drill 0.43 pad 0.61, 0.43 pad 0.74)  (1 unrouted)
  Top 0.305: 16.67,71.31 16.99,70.99 23.18,70.99 23.26,71.07 CON2.P$1 | 12.54,69.41 13.04,69.41 13.29,69.65 13.29,71.49 14.34,72.54 15.44,72.54 16.67,71.31 | 16.67,71.31 15.65,70.29 LED3.A 14.89,69.67 14.87,69.64 14.87,69.27 | 12.54,69.41 LED1.C | 12.54,69.41 12.52,69.43 LED2.A | v3.26,40.08 R22.2 C9.2 | 3.43,29.27 3.87,27.91 7.52,27.91 7.68,27.75 | 3.43,29.27 2.11,29.17 1.68,28.92 1.68,26.37 v1.68,26.32 1.68,23.43 2.12,22.29 9.96,22.14 R11.2 | C11.2 3.43,29.27 | v13.83,36.95 14.01,36.78 14.05,36.73 R14.1 | 9.4,56.39 8.05,57.74 v8.05,58.13 R35.1 | 16.06,60.5 16.06,60.46 15.24,59.68 v14.79,59.68 | 14.87,69.27 16.06,68.07 16.06,60.5 | 16.06,60.5 16.84,60.5 R37.2 17.85,59.39 18.95,59.39 19.26,59.09 R27.1 | 43.34,21.32 41.22,23.53 41.22,23.98 41.05,24.15 | 43.29,17.44 42.84,17.44 42.56,17.72 41.42,17.72 VR4.P$1 41.42,16.1 41.12,16.1 39.67,14.65 39.67,13.41 40.95,12.13 41.45,12.13 VR3.P$1 | ZD1.A 21.68,29.77 21.68,30.18 23.03,31.53 24.73,31.57 27.45,34.4 27.42,45.82 R31.1 26.04,45.81 | X9.2 29.55,54.46 29.35,53.59 26.04,50.27 26.04,45.81 | 26.04,45.81 25.08,45.81 25.08,43.96 24.97,43.85 C8.2 R21.1 | LED4.C 14.87,69.27 | 9.4,56.39 9.4,53.98 9.53,53.85 IC2.5 | 43.34,18.57 43.29,17.95 43.29,17.44 | 44.57,18.54 Q2.P$6 | 45.84,18.53 45.58,18.52 Q2.P$7 | Q2.P$8 47.11,18.53 | Q4.P$2 13.43,6.54 13.56,6.42 X7.1 | R4.1 7.68,27.75 | 7.68,27.75 7.71,27.77 7.71,28.05 R3.1 | R33.1 36.48,59.57 v36.7,59.35 | IC2.3 9.4,56.39 | Q2.P$5 43.29,17.44 | 41.92,40.4 CV5.2
  Top 0.406: USB2.P$8 53.81,50.18 54.59,50.96 54.59,56.02 53.83,56.78 USB2.P$11 | 50.15,50.03 v48.79,50.02
  Top 0.61: X5.2 36.58,21.96
  Top 0.813: 40.2,25.03 38.22,23.91 36.58,22.73 36.58,21.96 | 43.34,21.32 43.34,18.57 Q2.P$6 | 41.05,24.15 40.2,25.03 | 40.2,25.03 TP12.P$1 | 45.58,18.52 44.79,18.5 44.57,18.54 | 47.11,18.53 45.84,18.53 | 50.5,56.78 USB2.P$11
  Top 1.27: USB2.P$6 50.15,50.03 CIN-NEG.2 | COUT1-NEG.1 36.21,55.27 L1-NEG.2 33.52,55.73 32.48,54.69 X9.2
  Bottom 0.406: v36.7,59.35 34.3,59.35 X9.2
  Bottom 1.27: v48.79,50.02 48.9,57.29
  other vias: 35.17,46.99 34.67,47.45 34.14,47.93 33.66,48.37 48.83,54.87 48.85,55.48 48.85,56.09 48.83,56.71 48.85,57.34 48.12,50.02 43.34,21.35 43.34,20.62 20.82,21.47 21.42,21.97 23.46,23.54 24.08,24.07 21.6,21.2 23.3,24.3
  pour Top (isolate 0.254, no thermals): 42.3,25.7 42.3,44 38.8,44 38.8,25.7
  pour Bottom (isolate 0.254, no thermals): 32.8,44 32.8,25.7 51.9,25.7 51.9,44
  pour Top (isolate 0.254, rank 6, no thermals): 32.8,44.8 47.6,44.8 47.6,59.5 32.8,59.5
  pour Bottom (isolate 0.254, no thermals): 47.8,44.7 32.8,44.7 32.8,59.8 47.8,59.8
  pour Top (isolate 0.16, no thermals): 51,54.6 51,57.9 48.5,57.9 48.5,54.6
  pour Top (isolate 0.254, no thermals): 39,45 39,44 42.3,44 42.3,45
  pour Bottom (isolate 0.254, no thermals): 48.9,58.3 48.9,54.4 47.7,54.4 47.7,58.3
  pour Bottom (isolate 0.254, hatched): 0.1,74.9 55.2,74.9 55.2,-0.1 0.1,-0.1
  pour Top: 20.3,21 20.6,20.7 21.8,20.7 24.9,23.8 24.9,24.3 24.4,24.8 23.2,24.8 21,22.6 20.1,21.7 20.1,21.2
LASERONOFF
  Top 0.254: Q4.P$1 13.43,9.83 11.9,11.36 11.9,14.53 13.82,16.45 R7.2
MIRROREN  (via drill 0.43 pad 0.61)
  Top 0.305: Q1.P$5 48.99,18.36 48.99,18.07 | Q1.P$6 50.26,18.07 | 51.7,18.13 51.53,18.07 Q1.P$7
  Top 0.61: X5.1 36.58,19.71
  Top 0.813: 36.58,19.71 36.29,19.43 v36.25,18.91 | 48.99,18.07 50.26,18.07 50.46,18.11 50.84,18.17 51.53,18.07 | 53.31,18.21 Q1.P$8 | 53.31,18.21 53.31,14.63 51.5,13.2 X6.P$2 | 53.31,18.21 51.7,18.13
  Bottom 0.813: X6.P$2 50.26,11.95 48,14.21 41.1,14.21 v36.25,18.91
N$1  (via drill 0.43 pad 0.74)
  Top 0.356: U1.P6 47.41,34.49
  Top 0.406: 47.41,34.49 v47.92,34.96
  Top 1.27: REN.2 44.41,40.58 44.37,40.55 CV5.1 44.44,39.91 v46.24,39.91 46.3,39.91 RB0.1
  Bottom 0.406: v47.92,34.96 47.96,38.32 46.3,39.91 v46.24,39.91
N$2  (via drill 0.43 pad 0.74)
  Top 0.406: U1.P3 40.98,34.5 v39.93,34.47 | REN.1 40.97,42.17 v40.09,41.29
  Bottom 0.406: v39.93,34.47 40.09,34.56 v40.09,41.29
N$3
  Top 0.254: VR2.E 24.49,66.86 28.44,70.81 28.44,71.31 30.57,73.44 JP3.1 40.43,72.26 41.01,71.68 C3.2
  Bottom 0.254: VR2.E 18.72,65.94 15.3,62.52 TP22.P$1
N$4  (via drill 0.43 pad 0.61)
  Top 0.305: R1.2 25.25,47.42 v25.25,51.96 | R2.1 2.25,46.3 2.25,61.78 5.24,64.78 5.24,67.79 8.35,70.9 8.71,70.9 VR1.A | 45.92,72.94 46.01,72.86 C1.2 | v45.32,73.54 45.92,72.94 | JP1.1 45.92,72.94
  Bottom 0.305: 43,73.54 43,69.05 30.08,56.13 29.42,56.13 v25.25,51.96 | 43,73.54 v45.32,73.54 | 43,73.54 19.38,73.54 18.72,72.88 VR2.A 10.33,71.94 10.23,71.84 VR1.A
N$5
  Top 0.254: R34.1 8.15,63.78 7.2,64.73 7.2,67.14 8.45,68.38 8.71,68.38 VR1.S
N$6
  Top 0.254: R5.1 R1.1 21.08,46.13 20.43,45.48 18.81,45.44 18.71,45.86 18.69,46.32 17.04,47.92 IC1.13
N$7  (via drill 0.43 pad 0.61)
  Top 0.254: v13.91,24.48 13.91,25.18 12.87,26.22 IC3.5 11.49,26.22 11.49,27.99 11.63,28.13 13.56,28.13 13.7,28.27 13.7,29.2 13.5,29.4 9.61,29.4 | 9.61,29.4 R3.2 | R18.2 4.19,33.45 7.45,33.45 9.61,30.44 9.61,29.4
  Bottom 0.254: X7.2 11.02,21.59 v13.91,24.48
N$8  (via drill 0.43 pad 0.61)
  Top 0.254: v12.34,51.34 11.99,51.46 11.51,51.95 9.62,51.95 6.15,55.42 R35.2 6.15,61.18 6.25,61.28 6.25,61.73 R34.2 | IC1.12 17.04,46.65 17.63,46.06 v17.89,46.06
  Bottom 0.254: v12.34,51.34 11.52,50.74 11.52,50.13 15.58,46.06 v17.89,46.06
N$9
  Top 0.254: VR4.P$3 40.55,16.91 40.55,17.57 41.73,18.75 41.73,20.25 40.88,21.1 40.14,21.1 X3.2
N$10
  Top 0.254: IC3.12 19.88,28.77 20.39,28.19 20.39,27.57 ZD1.C 21.83,27.57 22.23,27.98 R23.1
N$11
  Top 0.254: R12.2 R11.1 9.11,19.75 11.2,19.66 11.49,21.63 11.49,24.95 IC3.6
N$12
  Top 0.254: IC1.2 9.43,47.92 9.43,46.9 8.38,45.85 6.59,45.85 6.14,46.3 R2.2 R6.2
N$13
  Top 0.254: TP23.P$1 44.3,7.44 44.69,7.44 45.18,7.93 45.18,8.4 IC4.3 43.32,8.4 43.3,8.43 VR3.P$2
N$14
  Top 0.254: R36.2 17.85,64.08 17.2,64.73 17.2,67.22 18.46,68.48 18.72,68.48 VR2.S
N$15  (via drill 0.43 pad 0.61)
  Top 0.254: v20.62,58.28 20.73,58.39 20.73,60.5 R37.1 R36.1 | IC1.3 11.63,46.65 11.63,49.68 10.85,50.47 10.33,50.47 v10.36,50.36
  Bottom 0.254: v20.62,58.28 18.14,58.28 v10.36,50.36
N$16  (via drill 0.43 pad 0.74)
  Top 0.406: U1.P8 46.23,35.79 v46.54,36.59 | CSS.1 38.78,43.2 v39.6,43.2
  Bottom 0.406: v39.6,43.2 41.65,43.2 47.05,37.8 47.05,36.61 v46.54,36.59
N$17
  Top 0.254: 19.52,39.55 19.79,39.28 R19.2 | 19.52,39.55 19.52,40.36 17.04,42.84 IC1.9 | R24.1 19.52,39.55
N$18
  Top 0.254: IC2.1 11.63,58.93 11.63,61.55 12.5,62.41 R9.1
N$19
  Top 0.254: IC1.6 9.43,42.84 9.43,42.3 7.71,40.58 R25.1 R20.2
N$20  (via drill 0.43 pad 0.61)
  Top 0.254: R10.1 14.73,62.41 13.84,61.52 v13.84,55.99 | v7.02,52.38 8.09,51.31 IC2.7
  Bottom 0.254: v13.84,55.99 10.63,55.99 v7.02,52.38
N$21  (via drill 0.43 pad 0.61)
  Top 0.305: v43.18,16.23 43.26,16.31 43.4,16.31 IC5.1 | IC5.4 47.92,14.41 48.96,15.45 X6.P$3
  Bottom 0.305: X6.P$3 43.95,15.45 v43.18,16.23
N$22  (via drill 0.43 pad 0.61)
  Top 0.305: v44.36,11.27 44.25,11.15 IC4.1 | IC4.4 47.82,8.4 47.87,8.45 X6.P$1
  Bottom 0.305: X6.P$1 47.18,8.45 v44.36,11.27
N$23
  Top 0.254: VR3.P$3 39.75,12.11 38.87,12.99 38.87,17.48 39.9,18.52 40.24,18.52 X2.2
N$24
  Top 0.254: IC5.3 43.42,14.41 43.42,13.48 42.94,13 | TP24.P$1 42.94,13 | 42.94,13 42.83,13 42.46,13 41.45,14.01 VR4.P$2
N$25
  Top 0.254: IC3.2 13.72,30.03 15.96,32.26 R13.1 R14.2
N$26
  Top 0.305: TP15.P$1 21.67,13.21 21.66,13.21
  Top 0.406: Q3.P$3 19.47,13.54 19.87,13.54
  Top 0.813: 19.87,13.54 21.33,13.54 21.66,13.21 26.44,8.43 26.57,8.3 LD1.P$1
N$27
  Top 0.254: IC3.7 13.7,23.68 13.7,20.32 13.82,20.2 | 13.82,20.2 13.82,20.31 15.21,21.7 TP8.P$1 | 13.82,20.2 13.82,20.14 R7.1
N$28  (via drill 0.43 pad 0.61)
  Top 0.254: v42.09,23.75 42.05,23.57 42.76,22.86 43.29,22.86 Q2.P$4 43.29,24.52 43.91,25.14 48.99,25.14 Q1.P$4 | R32.2 24.63,33.39 v24.69,32.68
  Bottom 0.254: v42.09,23.75 41.62,24.04 33.84,24.01 24.95,32.65 v24.69,32.68
N$29
  Top 0.254: C6.1 9.61,25.54 9.59,25.56 R4.2 10.56,26.64 10.71,26.8 10.71,27.44 11.03,27.76 11.03,28.32 11.3,28.58 11.49,28.58 11.49,28.76 IC3.3
N$30
  Top 0.254: C6.2 C4.1 5.03,25.54 4.99,25.57 R8.2
N$31  (via drill 0.43 pad 0.61)
  Top 0.254: R8.1 3.09,27.73 2.69,27.73 v2.54,28.17 | D4.A 9.97,31.65 10.57,31.65 v10.66,31.74 11.1,31.3 IC3.1 13.14,31.3 13.7,31.3 13.7,31.78 13.07,32.4 13.07,33.34 R13.2
  Bottom 0.254: v10.66,31.74 6.83,27.91 v2.54,28.17
N$32
  Top 0.254: Q1.P$2 51.53,23.49 | Q1.P$3 50.26,23.49 | 50.25,22.54 50.26,22.93 | 47.1,22.86 47.09,22.54 47.1,23.01 Q2.P$1 | 45.83,22.86 45.83,23.41 Q2.P$2 | Q2.P$3 44.56,22.86
  Top 0.813: Q1.P$1 52.8,22.93 52.08,22.93 51.53,23.49 51.53,22.93 50.81,22.93 50.26,23.49 50.26,22.93 | 47.09,22.54 50.25,22.54 | 45.83,23.41 46.38,22.86 47.1,22.86 | 44.56,22.86 45.83,22.86
N$33
  Top 0.254: C11.1 5.01,30.25 5.03,30.27 R18.1 6.25,32.06 6.65,32.02 D4.C
N$34
  Top 0.406: U1.P2 40.5,35.14 40.04,35.27 39.12,35.28 38.53,34.69 38.53,33.37 RF1.1
  Top 1.27: RF2.2 RF1.1
N$35
  Top 0.406: 40.5,36.19 40.9,35.79 U1.P1
  Top 0.61: 40.5,36.19 39.61,36.19 CC1.1
  Top 1.27: CC2.1 38.43,38.82 CC1.1
N$36
  Top 1.27: RC1.2 CC1.2
N$37
  Top 0.254: 16.2,16.34 14.52,14.65 14.52,13.31 VR5.P$2 | R16.1 16.2,16.34 | VR5.P$3 16.69,15.85 16.2,16.34
N$38  (via drill 0.43 pad 0.61)
  Top 0.254: 26.19,42.7 R30.1 | R31.2 26.19,42.7 | v25.65,42.7 26.19,42.7 | TP14.P$1 20.9,35.64 20.9,35.05 20.16,35.05 15.97,30.86 15.97,25.87 16.89,24.95 IC3.9
  Bottom 0.254: TP14.P$1 20.9,36.52 25.65,41.28 v25.65,42.7
N$39
  Top 0.254: LED2.C 12.52,70.96 11.97,70.96 11.77,70.76 11.77,68.24 11.99,68.02 12.54,68.02 LED1.A 12.54,66.32 12.5,66.27 R9.2
N$40
  Top 0.61: U2.3 42.77,50.17 RF2-NEG.1
  Top 1.27: RF2-NEG.1 42.76,47.68 RF1-NEG.1
N$42
  Top 0.254: IC3.8 19.1,23.68 19.1,25.45 18.95,25.59 17.08,25.59 16.43,26.24 16.43,28.78 17.05,29.4 19.16,29.4 22.23,32.47 22.23,32.8 R32.1
N$44
  Top 0.254: LED3.C 14.89,71.06 14.34,71.06 14.12,70.83 14.12,68.31 14.32,68.12 14.87,68.12 LED4.A 14.87,66.41 14.73,66.27 R10.2
N$45
  Top 0.254: R17.2 19.33,11.21 19.33,11.7 18.72,12.31 | VR5.P$1 18.72,12.31 | 18.72,12.31 18.83,12.42 18.83,14.14 18.91,14.22 19.47,14.22 19.94,14.55 Q3.P$1
  Top 0.305: TP16.P$1 20.91,10.71 R17.2
N$46
  Top 0.254: Q4.P$3 16.16,8.2 16.78,8.81 R17.1
N$47
  Top 0.254: IC2.8 17.04,51.31 17.41,51.69 R26.2 19.83,51.69 20.37,51.69 20.75,51.3 TP17.P$1 | R29.2 36.41,64.58 37.23,65.41 R28.2
  Bottom 0.254: R28.2 36.23,67.33 36.23,66.32 22.2,52.3 TP17.P$1
N$48
  Top 0.254: 18.75,53.59 19.26,54.1 R27.2 | 18.75,53.59 18.21,53.59 17.94,53.85 IC2.10 | R26.1 18.75,53.59
N$49
  Top 0.254: R15.1 TP13.P$1
  Top 0.61: 18.83,15.44 18.94,15.33 Q3.P$2
  Top 0.813: R15.1 18.83,16.96 18.83,15.44
N$51
  Top 0.254: CON1.P$1 51.08,67.26 51.08,68.75 48.89,70.94 C1.1 47.91,72.03 47.46,72.47 47.25,72.47 JP1.2
N$52
  Top 0.254: CON1.P$2 43.11,68.99 42.91,69.2 C3.1 41.25,72.26 JP3.2
N$53
  Top 0.254: JP2.1 45.17,74.41 47.71,74.41 48.89,73.23 48.89,72.12 51.54,69.47 53.34,69.47 53.94,68.87 53.94,61.86 51.94,59.86 CON1.P$3 49.08,59.86 49.08,66.22 48.21,67.09 48.21,67.63 C2.1
N$54  (via drill 0.43 pad 0.61)
  Top 0.254: 43.4,73.08 43.4,72.66 44,72.06 44,70.48 45.33,69.15 45.33,68.17 C2.2 | 43.4,73.08 42.56,73.08 v42.21,72.69 | JP2.2 43.4,73.08 | VR1.E 8.71,65.84 10.7,63.85 TP21.P$1
  Bottom 0.254: VR1.E 8.71,67.67 9.16,68.13 26.44,68.13 28.26,69.94 39.42,69.94 v42.21,72.69
SW+
  pour Top (isolate 0.254, rank 2, no thermals): 51.9,31.4 51.9,35.1 48.4,35.1 48.4,33.9 45,34 45,31.4
SW-
  Top 0.254: 40.55,54.47 41.14,54.47 D1-NEG.C
  Top 1.27: TP20.P$1 35.7,51.09 35.75,51.14 L1-NEG.1 38.9,52.63
  pour Top (isolate 0.254, rank 3, no thermals): 38.3,51.8 41,51.8 41,55.3 38.3,55.3
TOMIC
  Top 0.254: CON2.P$2 24.99,63.12 25.19,62.92 34.08,62.92 34.52,63.36 | 34.52,63.36 34.52,62.42 34.56,62.42 34.59,62.4 R33.2 | R29.1 34.52,63.36
TP5  (via drill 0.43 pad 0.61)
  Top 0.254: 14.82,41.57 13.09,43.31 13.08,49.61 13.62,49.95 13.62,54.21 13.09,54.58 13.09,56.21 11.63,57.66 IC2.2 | X2.1 41.05,20.09 40.69,20.45 38.7,20.45 36.74,18.09 35.93,18.1 33.86,18.13 30.22,22.43 v30.35,24.21 | 14.82,41.57 14.94,41.57 IC1.8 17.04,41.57 17.04,41.04 16.64,40.64 16.64,39.28 R24.2 | TP5.P$1 14.54,39.91 14.82,40.19 14.82,41.57
  Bottom 0.254: TP5.P$1 16.28,39.17 30.5,24.95 v30.35,24.21
TP6  (via drill 0.43 pad 0.61)
  Top 0.254: IC2.6 11.63,52.58 11.63,53.05 v11.76,53.17 | R25.2 9.61,39.76 9.43,39.94 9.43,41.57 IC1.7 11.52,41.57 12.61,40.49 12.61,39.8 TP6.P$1 | X3.1 40.95,23.03 40.52,23.03 v40.28,23.3
  Bottom 0.254: 12.98,39.07 12.98,46.13 9.62,49.37 9.62,51.05 v11.76,53.17 | 12.98,39.07 13.35,39.07 14.18,38.23 14.46,38.23 15.11,37.59 15.11,37.45 29.34,23.21 v40.28,23.3 | TP6.P$1 12.98,39.07
USB5V  (via drill 0.43 pad 0.61)
  Top 0.305: 41.99,52.94 U2.5
  Top 0.356: USB2.P$1 49.28,52.18 49.25,52.21
  Top 0.406: 49.25,52.21 49.11,52.21 48.98,52.34
  Top 0.61: 48.98,52.34 48.91,52.34 48.66,52.59
  Top 0.813: 48.66,52.59 48.56,52.59 48.4,52.75 | v42.96,54.73 42.96,52.96 U2.4
  Top 1.27: 50.02,37.27 49.93,39.96 49.93,42.09 | 45.2,55.12 v45.2,53.93 45.34,53.78 | 49.93,42.09 v49.24,42.78 | 49.93,42.09 49.93,42.13 | 48.4,52.75 v46.53,52.75 | v46.53,52.75 46.38,52.75 | 46.38,52.75 45.34,53.78 | v46.53,52.75 46.38,52.75 | 46.38,52.75 45.34,53.78
  Bottom 1.27: CIN-NEG.1 45.71,51.93 | v42.96,54.73 43.76,53.93 v45.2,53.93 v46.53,52.75
  Bottom 1.93: CIN-NEG.1 45.43,47.54 49.24,43.73 v49.24,42.78 49.42,42.6 TP7.P$1 | 45.71,51.93 v46.53,52.75
  other vias: 45.67,53.56 46.12,53.19 48.87,43.51 49.69,43.49
  pour Top (isolate 0.254, rank 3, no thermals): 51.9,44 51.9,31.3 42.9,31.3 42.9,44
  pour Top (isolate 0.254, rank 5, no thermals): 47.7,55.3 41.9,55.3 41.9,51.4 47.7,51.4
  pour Top (isolate 0.16, no thermals): 47.6,52.6 47.6,43.6 52,43.6 52,52.6
V+  (via drill 0.43 pad 0.61, 0.43 pad 0.74)
  Top 0.254: 24.39,28.8 27.49,31.9 | IC1.4 11.63,45.38 12.21,45.95 v12.34,50.32 13.1,50.47 13.1,53.77 11.63,55.12 IC2.4 | 24.39,28.8 24.39,27.14 19.73,22.48 19.37,22.48 17.64,22.48 13.7,26.41 13.7,27.49 IC3.4 | X7.3 9.56,3.67 9.56,3.54 10.56,2.53 14.02,2.53 14.65,3.16 14.65,9.64 12.36,11.93 12.36,14.26 14,15.9 14.23,15.9 14.9,16.58 14.9,17.92 R16.2 | 24.39,28.8 R23.2
  Top 0.406: 48.09,28.16 TP10.P$1 | D3.C 45.85,28.05 v45.3,27.5 COUT1.1 | RF1.2 37.71,28.93 v38.39,28.25
  Top 0.61: IC5.2 45.46,15.37 45.46,9.46
  Top 0.813: 37.98,10.07 41.39,9.83 41.87,9.35 IC4.2 45.18,9.35 45.46,9.46 | R15.2 17.49,19.11 17.39,19.21 R16.2
  Top 1.27: R15.2 20.45,19.11
  Top 1.93: v27.93,31.9 27.93,21.72 29.48,19.93 | 29.48,19.93 37.98,10.07 | 20.45,19.11 28.67,19.11 29.48,19.93
  Top 2.184: 27.49,31.9 v27.93,31.9
  Bottom 0.254: v12.34,50.32 29.58,50.39
  Bottom 0.305: v27.99,32.64 27.99,31.96 v27.93,31.9 28.29,31.9 v28.59,32.2
  Bottom 0.406: v38.39,28.25 44.55,28.25 v45.3,27.5
  Bottom 1.27: 29.7,32.02 29.58,50.39 X9.1 | 29.7,32.02 29.71,29.86 34.49,25.08 45.84,25.08 48.92,28.16 TP10.P$1 | 29.5,31.97 29.65,31.97 29.7,32.02
  Bottom 1.93: 29.5,31.97 v27.93,31.9
  other vias: 47.63,26.82 47.12,26.35 46.56,25.97
  pour Top (isolate 0.254, rank 5, no thermals): 42.6,25.7 42.6,30.6 51.9,30.6 51.9,25.7
V-  (via drill 0.43 pad 0.61)
  Top 0.254: IC1.11 14.82,45.38 14.82,49.98 14.94,50.1 | 14.94,50.1 22.7,50.1 24.44,51.84 24.44,52.31 28.5,56.15 28.99,56.63 X9.3 | 14.94,50.1 14.37,50.68 14.37,54.66 14.82,55.12 IC2.11 | IC3.11 18.87,27.45 | 46.09,16.3 45.93,16.21 45.92,16.21 | 46.65,16.31 IC5.5
  Top 0.305: 31.92,57.97 v34.32,57.41
  Top 0.406: 43.91,51.34 43.91,56.46 | 43.91,49.3 43.91,51.34 | 43.91,51.34 43.85,51.47 | 43.91,49.3 43.91,51.34 | 44.13,56.68 44.52,57.07 | RF2-NEG.2 43.91,49.3
  Top 0.61: 45.93,16.21 46.03,16.31 46.65,16.31 | v45.66,16.47 45.92,16.21 | 18.87,27.45 19.75,26.81 v19.86,25.33 | U2.2 41.91,50.26 41.91,51.24
  Top 0.813: 43.85,51.47 42.01,51.47 41.91,51.24 | IC4.5 50.62,10.3 50.71,10.21 52.34,10.21 54.46,11.77 54.46,17.22 v54.46,17.25 | v48.81,16.48 48.64,16.31 IC5.5
  Top 1.27: X9.3 30.41,58.06 37.6,58.06 | 38.24,58.06 COUT1-NEG.2 | 31.92,57.97 v34.32,57.41 | v31.92,33.66 31.88,22.56 v34.08,19.85
  Bottom 0.61: v19.86,25.33 25.26,19.85 v34.08,19.85 42.28,19.85 v45.66,16.47
  Bottom 0.813: v54.46,17.25 49.65,17.32 v48.81,16.48
  Bottom 1.27: v34.32,57.41 33.84,57.41 31.78,55.35 v31.92,33.66
  other vias: 33.12,56.91 33.69,57.32
  pour Top (isolate 0.254, rank 4, no thermals): 32.8,59.6 47.6,59.6 47.6,55.8 32.8,55.8

### Text on the board
tPlace: Peachy / r1.99-6f / 2014-09-03